# Altium schematic sheet PowerDrivers.SchDoc
size A4
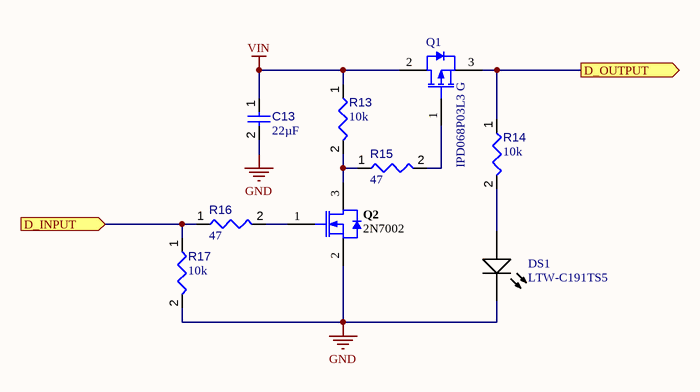
[diagram p0: PowerDrivers.SchDoc]

## Parts
C13  value 22µF  [CAPC0805(2012)145_L]  (hidden comment: Capacitor 22µF +/-40% 16V 0805)
DS1  LTW-C191TS5  [LTST-LTW-C191TS5_V]
Q1  IPD068P03L3 G  [INF-PG-TO252-3-1_L]
Q2  2N7002  [INF-PG-SOT23_M]
R13  value 10k  [RESC1608X55X25ML10T15]  (hidden comment: Resistor 10k +/-1% 0603 100 mW)
R14  value 10k  [RESC1608X55X25ML10T15]  (hidden comment: Resistor 10k +/-1% 0603 100 mW)
R15  value 47  [RESC1608X55X25ML10T15]  (hidden comment: Resistor 10k +/-1% 0603 100 mW)
R16  value 47  [RESC1608X55X25ML10T15]  (hidden comment: Resistor 10k +/-1% 0603 100 mW)
R17  value 10k  [RESC1608X55X25ML10T15]  (hidden comment: Resistor 10k +/-1% 0603 100 mW)

## Ports
D_INPUT (in), D_OUTPUT (out)

## Nets
GND: C13.2 DS1.2(K) Q2.2(SOURCE) R17.2
VIN: C13.1 Q1.2(DRAIN) R13.1
D_INPUT: R16.1 R17.1 ; port D_INPUT
D_OUTPUT: Q1.3(SOURCE) R14.1 ; port D_OUTPUT
NetDS1_1: DS1.1(A) R14.2
NetQ1_1: Q1.1(GATE) R15.2
NetQ2_1: Q2.1(GATE) R16.2
NetQ2_3: Q2.3(DRAIN) R13.2 R15.1

## Library data of the parts
C13 = CMP-001-00081-4: Chip Capacitor, 22µF +/-40%, 16V, 0805, Thickness 1.45 mm; Tolerance: 5%; Voltage Rating: 16V; Mounting Technology: SMT; Pins: 2; Max Operating Temperature: 85°C; Case/Package: 0805; Min Operating Temperature: -55°C
DS1 = CMP-007-00027-2: LED Uni-Color White, 70 mW, 20 mA, -20 to 80 degC, 2-Pin SMD, RoHS, Tape and Reel; Manufacturer: Lite-On; Power: 70mW; Forward Current: 5mA; Viewing Angle: 130degrees; Luminous Intensity: 28mcd; Lens Style: Diffused; Nominal Vf: 2.93V; Forward Voltage: 3.15V; Pins: 2; Illumination Colour: White; Datasheet Version: Rev. B, 06/2010; Package Quantity: 1; Colour: White; Package Reference: LTW-C191TS5; Mounting Technology: SM; Package Description: 2-Pin Surface Mount Device, Body 1.6 x 0.8 mm; Manufacturer URL: http://www.us.liteon.com/; Datasheet URL: http://optoelectronics.liteon.com/upload/download/DS22-2004-201/S_110_LTW-C191TS5.pdf; Max Operating Temperature: 80°C; Case/Package: 0603; RoHS Compliant: True; Min Operating Temperature: -20°C; Packaging: TapeandReel
Q1 = CMP-1099-00059-1: P-Channel OptiMOS P3 Power-Transistor, -30 V VDS, -70 A ID, -55 to 175 degC, PG-TO252-3-1, Reel, Green; Manufacturer: Infineon; VDS (max): -30Â V; ID (max): -70Â A; RDS (on) (max): 6.8Â mOhm; Green: TRUE; IDpuls (max): -280Â A; VGS(th) (min): -1Â V; VGS(th) (max): -2Â V; Pto t (max): 100Â W; QG: 68Â nC; RDS (on) (max) (@4.5V): 11Â mOhm; RthJC (max): 1.5 K/W; Rth: 1.5Â K/W; ComponentLink2URL: http://www.infineon.com/dgdl/IPD068P03L3+G_2+0.pdf?folderId=db3a304314dca38901154a7313d21a66&fileId=db3a30432313ff5e01232cc234f07d94; PackageReference: PG-TO252-3-1; ComponentLink3URL: http://www.infineon.com/dgdl/TLE42744_DS_11.pdf?folderId=db3a304318f3fe290118f5a433570040&fileId=db3a304327b897500128012ccafe37d2&sId=db3a30443d67b5ca013d83f7c0ea327b; Packing: Reel; PackageDescription: 3-Pin Plastic (Green) Transistor Single Outline Package, 6.5 x 6.12 mm Body, 2.28 mm Pitch; ComponentLink3Description: Package Specification; DatasheetVersion: Rev. 2.0; ComponentLink1Description: Manufacturer URL; ComponentLink2Description: Datasheet; PackageVersion: Jan-10; Mounting Technology: Surface Mount; ComponentLink1URL: http://www.infineon.com/; PartNumber: IPD068P03L3 G
Q2 = CMP-1149-00026-1: N-Channel OptiMOS Small-Signal-Transistor, 60 V VDS, 0.3 A ID, -55 to 150 degC, PG-SOT23, Reel, Green; Manufacturer: Infineon; RDS (on) (max) (@4.5V): 4,000 mOhm; VDS (max): 60 V; IDpuls (max): 1.2Â A; QG: 0.4Â nC; RDS (on) (max): 3,000 mOhm; RthJA (max): 250 K/W; ID (max): 0.3Â A; VGS(th) (max): 2.5Â V; VGS(th) (min): 1.5Â V; Green: TRUE; Ptot (max): 0.5Â W; PackageDescription: 3-Pin Small Outline Transistor Package, 2.9 x 1.3 mm Body, 0.95 mm Pitch; Halogen-free: TRUE; ComponentLink2Description: Datasheet; ComponentLink1URL: http://www.infineon.com/; Packing: Reel; DatasheetVersion: Rev. 2.4; PartNumber: 2N7002; PackageReference: PG-SOT23; PackageVersion: Apr-08; ComponentLink3URL: http://www.infineon.com/dgdl/SOT23-Package_Overview.pdf?folderId=db3a30431936bc4b0119532290053c66&fileId=db3a30431936bc4b0119533468123c85; ComponentLink1Description: Manufacturer URL; Mounting Technology: Surface Mount; ComponentLink3Description: Package Specification; ComponentLink2URL: http://www.infineon.com/dgdl/2N7002_Rev2.4.pdf?folderId=db3a3043156fd573011622e10b5c1f67&fileId=db3a304319bc939a0119c2a9461e79e6
R13-R17 = CMP-009-00017-5: Chip Resistor, 10 KOhm, +/- 1%, 01 W, -55 to 155 degC, 0603 (1608 Metric); Voltage Rating: 50V; Power: 100mW; RoHS Compliant: True; Min Operating Temperature: -55°C; Pins: 2; Case/Package: 0603; Mounting Technology: SM; Max Operating Temperature: 155°C; Tolerance: 1%